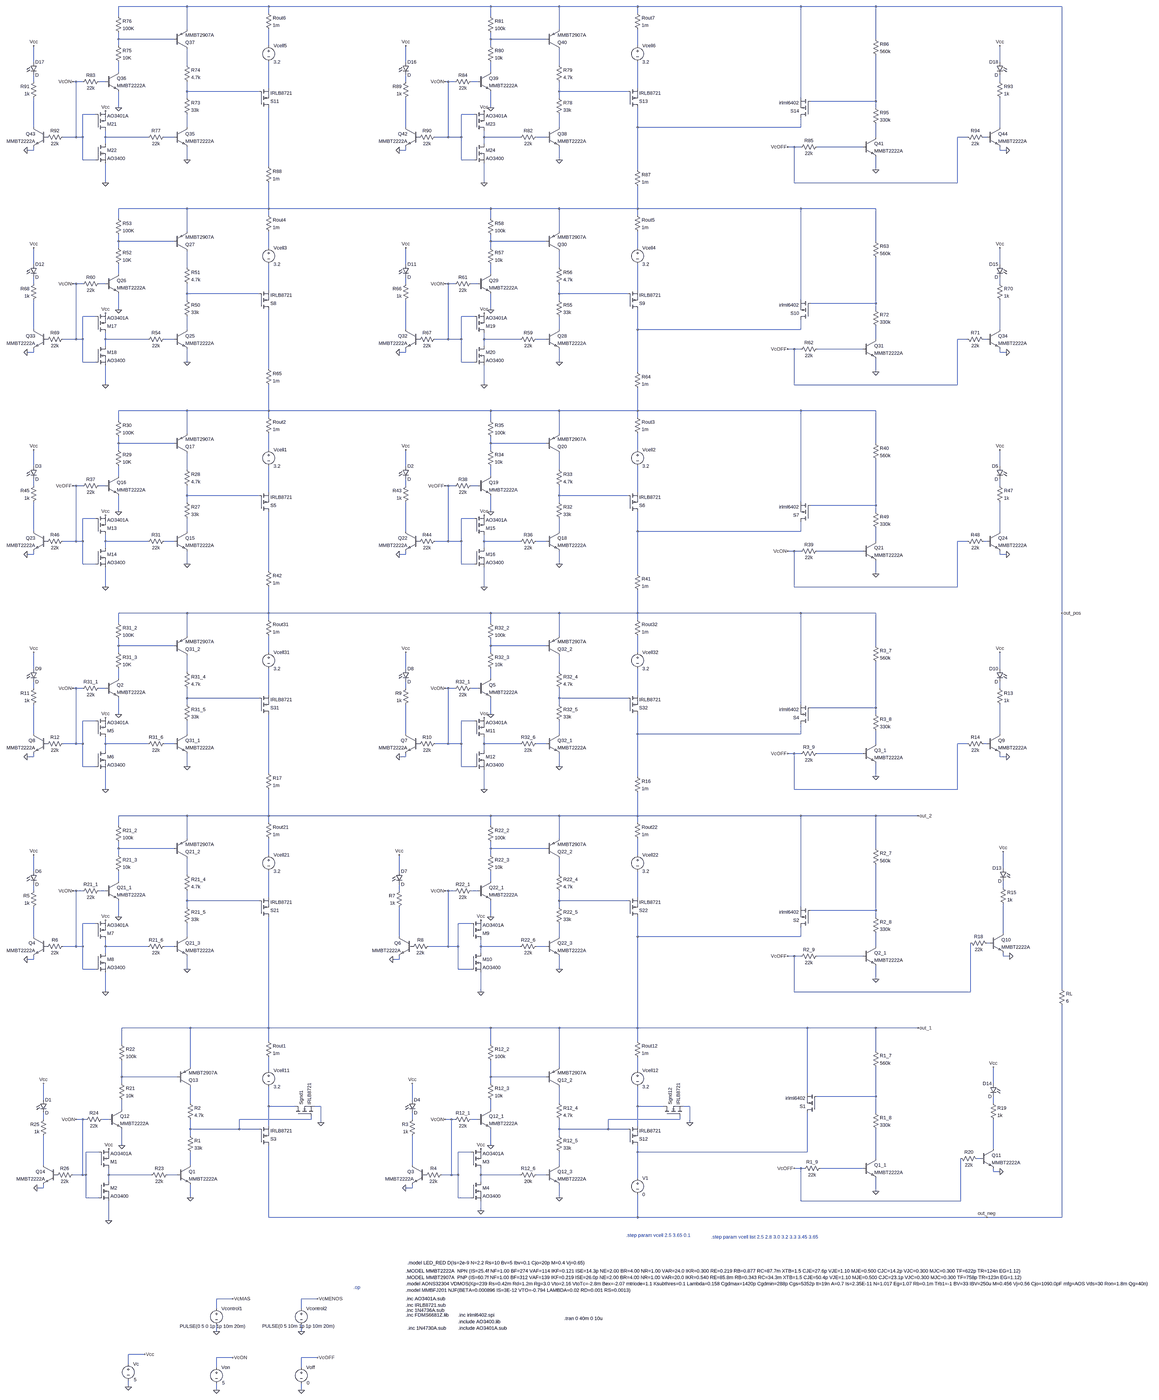
[diagram p0: schematic version_6x2.asc, whole sheet]
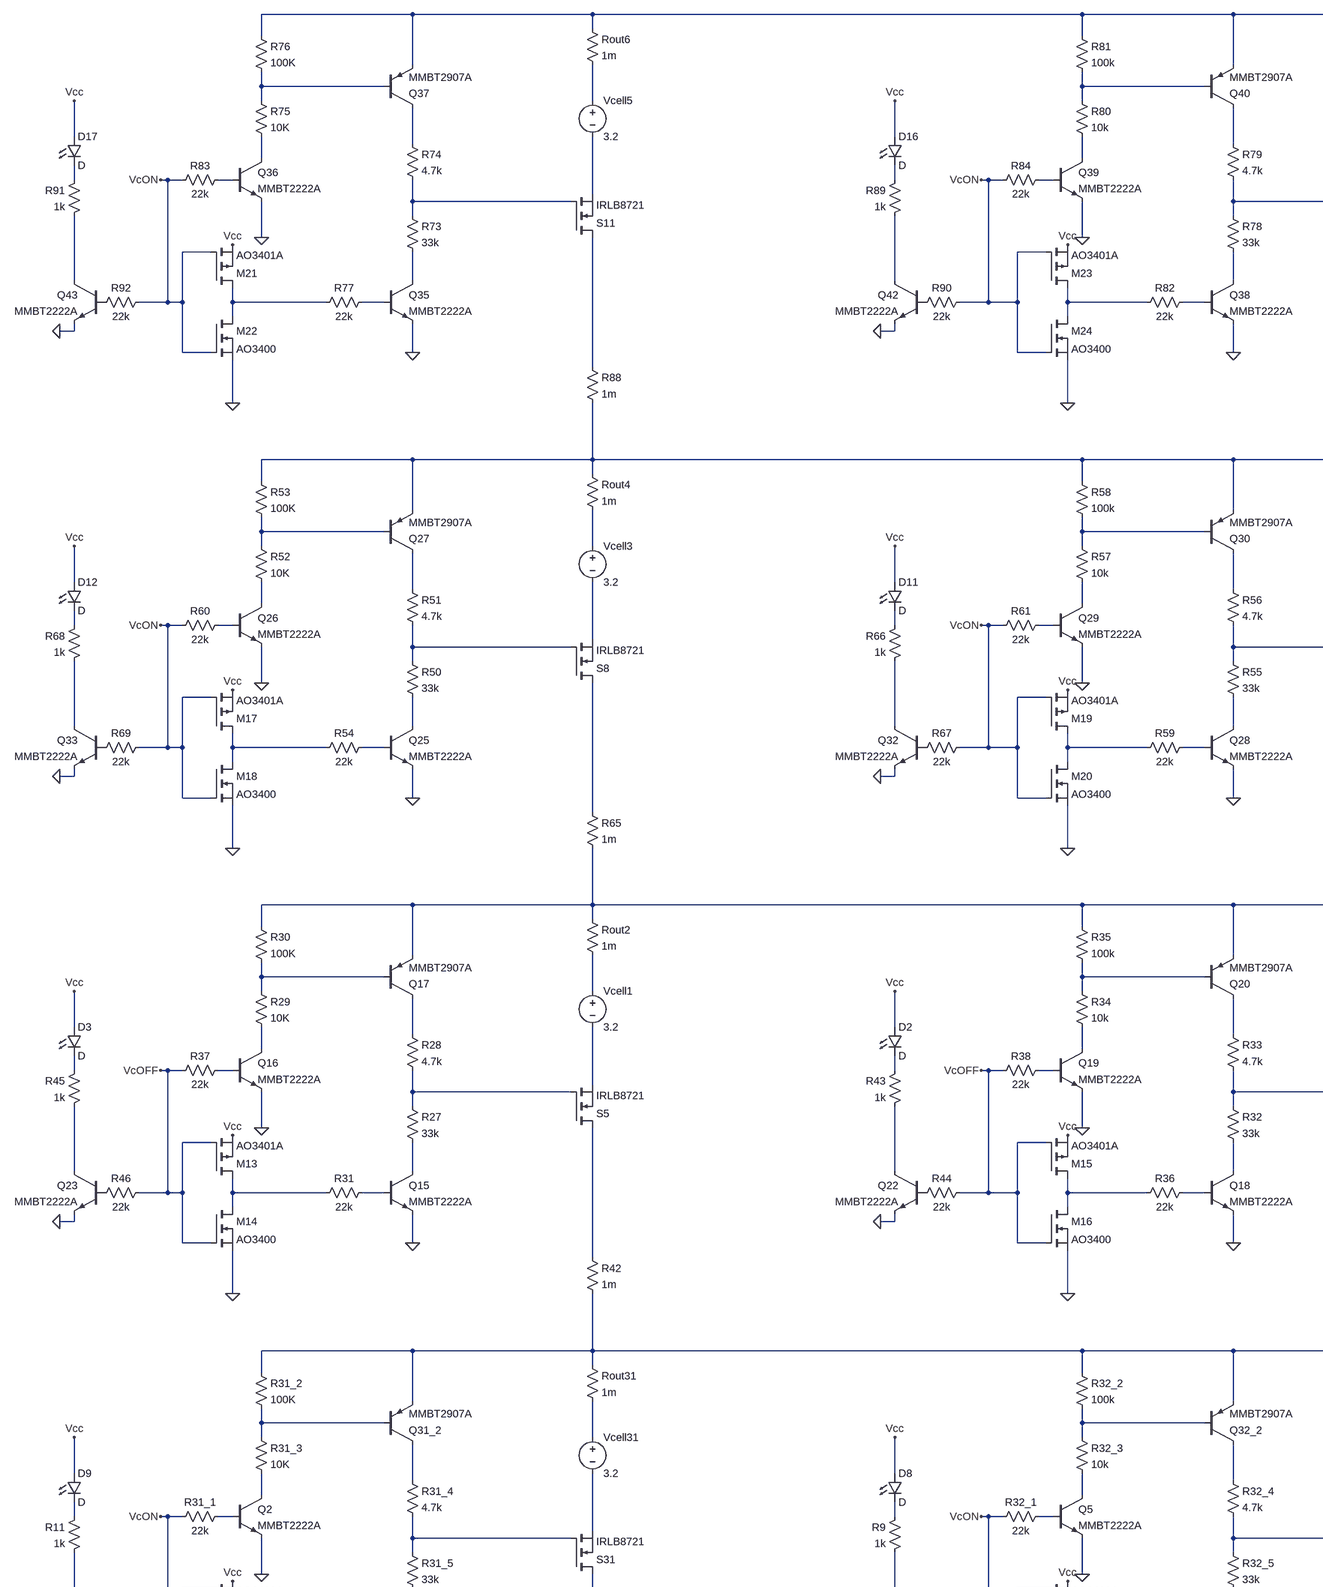
[diagram p1: schematic version_6x2.asc, part, row 1 of 2, column 1 of 2]
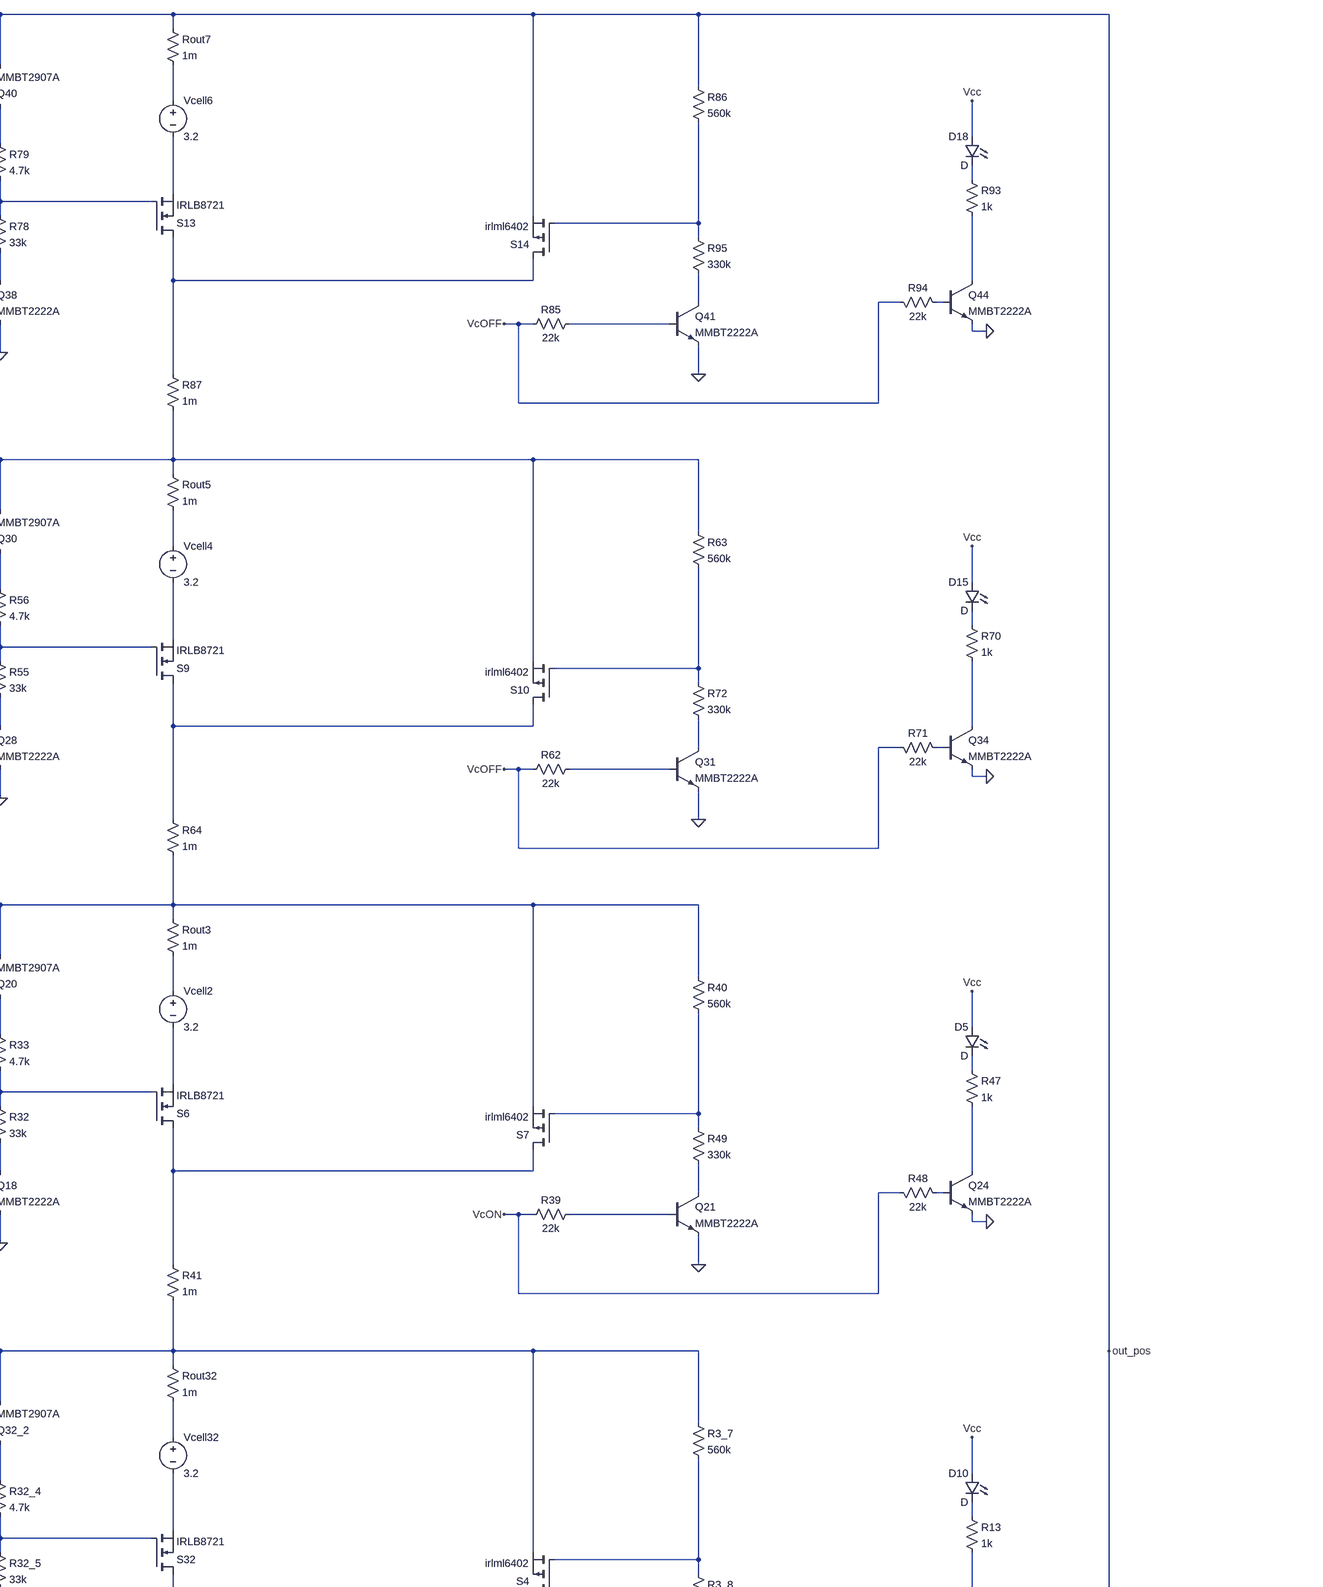
[diagram p2: schematic version_6x2.asc, part, row 1 of 2, column 2 of 2]
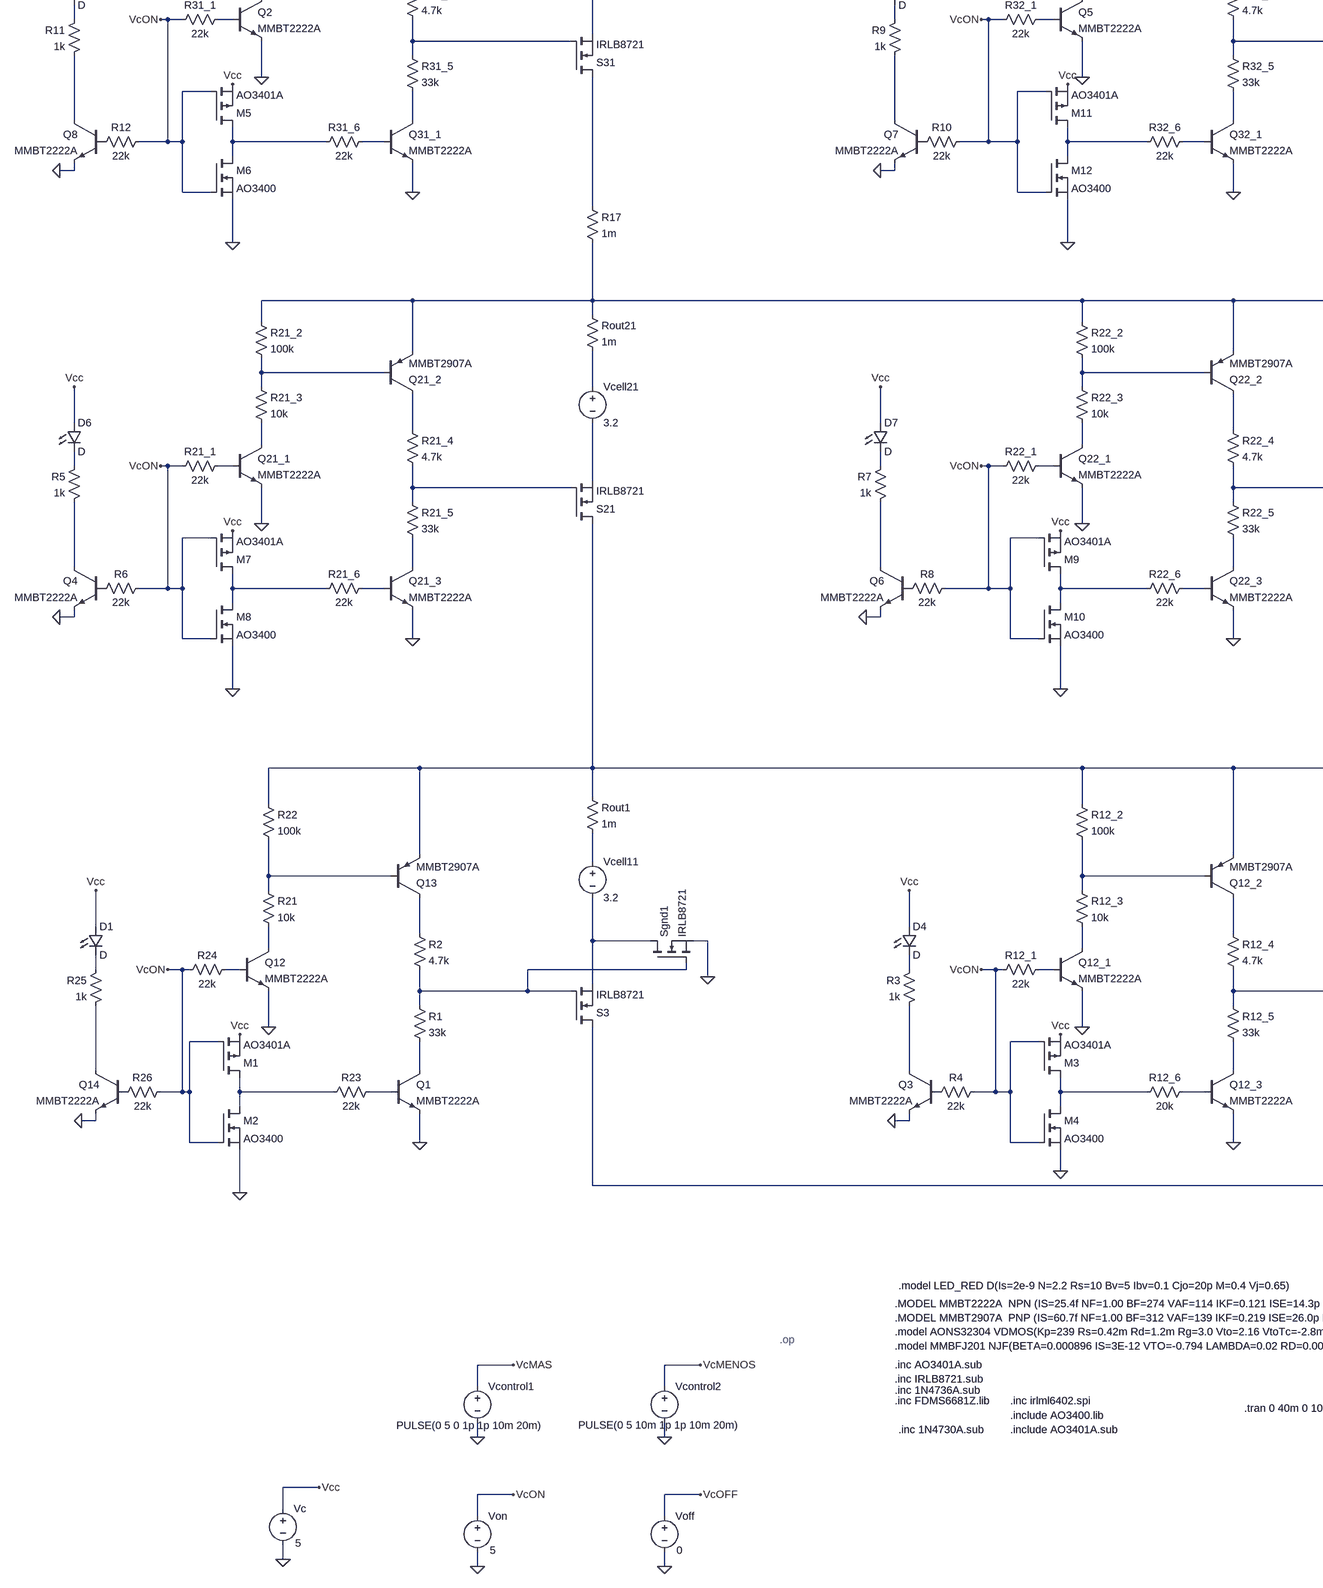
[diagram p3: schematic version_6x2.asc, part, row 2 of 2, column 1 of 2]
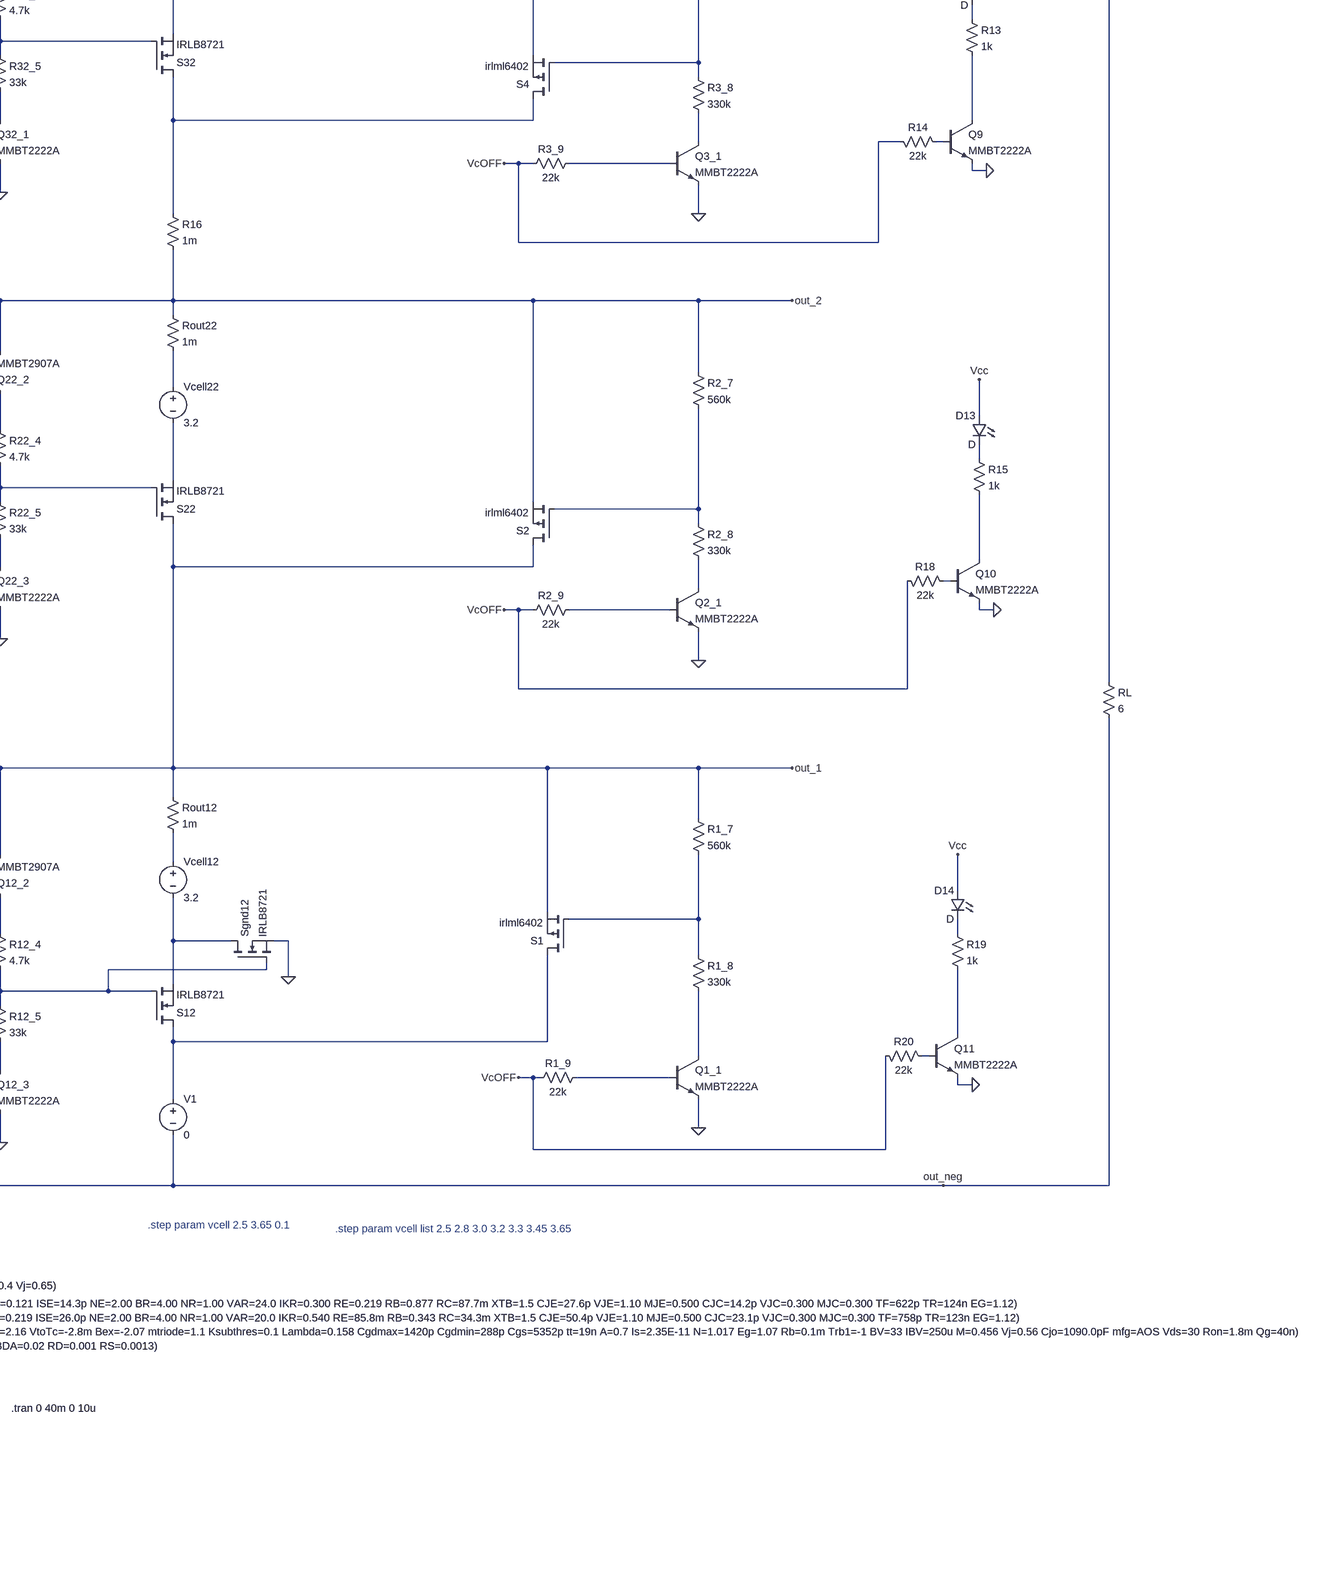
[diagram p4: schematic version_6x2.asc, part, row 2 of 2, column 2 of 2]
* version_6x2.asc
Q12_3 N187 N192 0 0 MMBT2222A
R12_5 N179 N187 33k
R12_4 N168 N179 4.7k
Q12_1 N173 N178 0 0 MMBT2222A
R12_3 N165 N173 10k
R12_2 out_1 N165 100k
R12_6 N192 N191 20k
Vcell12 N163 N171 3.2
Q12_2 N168 N165 out_1 0 MMBT2907A
X§S12 N181 N179 N171 IRLB8721  ; pins D G S
Q21_3 N152 N157 0 0 MMBT2222A
R21_5 N147 N152 33k
R21_4 N136 N147 4.7k
Q21_1 N138 N142 0 0 MMBT2222A
R21_3 N132 N138 10k
R21_2 out_2 N132 100k
R21_6 N157 N156 22k
Vcell21 N134 N145 3.2
Q21_2 N136 N132 out_2 0 MMBT2907A
X§S21 out_1 N147 N145 IRLB8721  ; pins D G S
Q22_3 N154 N159 0 0 MMBT2222A
R22_5 N148 N154 33k
R22_4 N137 N148 4.7k
Q22_1 N139 N144 0 0 MMBT2222A
R22_3 N133 N139 10k
R22_2 out_2 N133 100k
R22_6 N159 N158 22k
Vcell22 N135 N146 3.2
Q22_2 N137 N133 out_2 0 MMBT2907A
X§S22 out_1 N148 N146 IRLB8721  ; pins D G S
Vcontrol1 VcMAS 0 PULSE(0 5 0 1p 1p 10m 20m)
Vcontrol2 VcMENOS 0 PULSE(0 5 10m 1p 1p 10m 20m)
Voff VcOFF 0 0
Von VcON 0 5
R21_1 N142 VcON 22k
R22_1 N144 VcON 22k
R12_1 N178 VcON 22k
Rout12 out_1 N163 1m
Rout21 out_2 N134 1m
Rout22 out_2 N135 1m
Q1_1 N182 N188 0 0 MMBT2222A
R1_9 N188 VcOFF 22k
R1_7 out_1 N166 560k
Q2_1 N160 N161 0 0 MMBT2222A
R2_9 N161 VcOFF 22k
R2_7 out_2 N149 560k
X§Sgnd12 N171 N179 0 IRLB8721  ; pins D G S
Q31_1 N119 N125 0 0 MMBT2222A
R31_5 N115 N119 33k
R31_4 N104 N115 4.7k
Q2 N106 N109 0 0 MMBT2222A
R31_3 N100 N106 10K
R31_2 N099 N100 100K
R31_6 N125 N124 22k
Vcell31 N102 N113 3.2
Q31_2 N104 N100 N099 0 MMBT2907A
X§S31 N131 N115 N113 IRLB8721  ; pins D G S
Q32_1 N121 N127 0 0 MMBT2222A
R32_5 N116 N121 33k
R32_4 N105 N116 4.7k
Q5 N107 N111 0 0 MMBT2222A
R32_3 N101 N107 10k
R32_2 N099 N101 100k
R32_6 N127 N126 22k
Vcell32 N103 N114 3.2
Q32_2 N105 N101 N099 0 MMBT2907A
X§S32 N122 N116 N114 IRLB8721  ; pins D G S
R31_1 N109 VcON 22k
R32_1 N111 VcON 22k
Rout31 N099 N102 1m
Rout32 N099 N103 1m
Q3_1 N128 N130 0 0 MMBT2222A
R3_9 N130 VcOFF 22k
R3_7 N099 N117 560k
R16 N122 out_2 1m
R17 N131 out_2 1m
X§S4 N122 N117 N099 irlml6402  ; pins D G S
X§S2 out_1 N149 out_2 irlml6402  ; pins D G S
X§S1 N181 N166 out_1 irlml6402  ; pins D G S
V1 N181 out_neg 0
Q3 N186 P001 0 0 MMBT2222A
R3 N177 N186 1k
R4 VcON P001 22k
D4 Vcc N177 D
Q4 N151 P002 0 0 MMBT2222A
R5 N141 N151 1k
R6 VcON P002 22k
D6 Vcc N141 D
Q6 N153 P003 0 0 MMBT2222A
R7 N143 N153 1k
R8 VcON P003 22k
D7 Vcc N143 D
Q7 N120 P004 0 0 MMBT2222A
R9 N110 N120 1k
R10 VcON P004 22k
D8 Vcc N110 D
Q8 N118 P005 0 0 MMBT2222A
R11 N108 N118 1k
R12 VcON P005 22k
D9 Vcc N108 D
Q9 N123 N129 0 0 MMBT2222A
R13 N112 N123 1k
R14 VcOFF N129 22k
D10 Vcc N112 D
Q10 N150 N155 0 0 MMBT2222A
R15 N140 N150 1k
R18 VcOFF N155 22k
D13 Vcc N140 D
Q11 N180 N183 0 0 MMBT2222A
R19 N169 N180 1k
R20 VcOFF N183 22k
D14 Vcc N169 D
R1_8 N166 N182 330k
R2_8 N149 N160 330k
R3_8 N117 N128 330k
Q1 N185 N190 0 0 MMBT2222A
R1 N176 N185 33k
R2 N167 N176 4.7k
Q12 N172 N175 0 0 MMBT2222A
R21 N164 N172 10k
R22 out_1 N164 100k
R23 N190 N189 22k
Vcell11 N162 N170 3.2
Q13 N167 N164 out_1 0 MMBT2907A
X§S3 out_neg N176 N170 IRLB8721  ; pins D G S
R24 N175 VcON 22k
Rout1 out_1 N162 1m
X§Sgnd1 N170 N176 0 IRLB8721  ; pins D G S
Q14 N184 P006 0 0 MMBT2222A
R25 N174 N184 1k
R26 VcON P006 22k
D1 Vcc N174 D
RL out_pos out_neg 6
X§M1 N189 VcON Vcc AO3401A  ; pins D G S
X§M2 N189 VcON 0 AO3400  ; pins D G S
Vc Vcc 0 5
X§M3 N191 VcON Vcc AO3401A  ; pins D G S
X§M4 N191 VcON 0 AO3400  ; pins D G S
X§M5 N124 VcON Vcc AO3401A  ; pins D G S
X§M6 N124 VcON 0 AO3400  ; pins D G S
X§M7 N156 VcON Vcc AO3401A  ; pins D G S
X§M8 N156 VcON 0 AO3400  ; pins D G S
X§M9 N158 VcON Vcc AO3401A  ; pins D G S
X§M10 N158 VcON 0 AO3400  ; pins D G S
X§M11 N126 VcON Vcc AO3401A  ; pins D G S
X§M12 N126 VcON 0 AO3400  ; pins D G S
Q15 N086 N092 0 0 MMBT2222A
R27 N082 N086 33k
R28 N071 N082 4.7k
Q16 N073 N076 0 0 MMBT2222A
R29 N067 N073 10K
R30 N066 N067 100K
R31 N092 N091 22k
Vcell1 N069 N080 3.2
Q17 N071 N067 N066 0 MMBT2907A
X§S5 N098 N082 N080 IRLB8721  ; pins D G S
Q18 N088 N094 0 0 MMBT2222A
R32 N083 N088 33k
R33 N072 N083 4.7k
Q19 N074 N078 0 0 MMBT2222A
R34 N068 N074 10k
R35 N066 N068 100k
R36 N094 N093 22k
Vcell2 N070 N081 3.2
Q20 N072 N068 N066 0 MMBT2907A
X§S6 N089 N083 N081 IRLB8721  ; pins D G S
R37 N076 VcOFF 22k
R38 N078 VcOFF 22k
Rout2 N066 N069 1m
Rout3 N066 N070 1m
Q21 N095 N097 0 0 MMBT2222A
R39 N097 VcON 22k
R40 N066 N084 560k
R41 N089 N099 1m
R42 N098 N099 1m
X§S7 N089 N084 N066 irlml6402  ; pins D G S
Q22 N087 P007 0 0 MMBT2222A
R43 N077 N087 1k
R44 VcOFF P007 22k
D2 Vcc N077 D
Q23 N085 P008 0 0 MMBT2222A
R45 N075 N085 1k
R46 VcOFF P008 22k
D3 Vcc N075 D
Q24 N090 N096 0 0 MMBT2222A
R47 N079 N090 1k
R48 VcON N096 22k
D5 Vcc N079 D
R49 N084 N095 330k
X§M13 N091 VcOFF Vcc AO3401A  ; pins D G S
X§M14 N091 VcOFF 0 AO3400  ; pins D G S
X§M15 N093 VcOFF Vcc AO3401A  ; pins D G S
X§M16 N093 VcOFF 0 AO3400  ; pins D G S
Q25 N053 N059 0 0 MMBT2222A
R50 N049 N053 33k
R51 N038 N049 4.7k
Q26 N040 N043 0 0 MMBT2222A
R52 N034 N040 10K
R53 N033 N034 100K
R54 N059 N058 22k
Vcell3 N036 N047 3.2
Q27 N038 N034 N033 0 MMBT2907A
X§S8 N065 N049 N047 IRLB8721  ; pins D G S
Q28 N055 N061 0 0 MMBT2222A
R55 N050 N055 33k
R56 N039 N050 4.7k
Q29 N041 N045 0 0 MMBT2222A
R57 N035 N041 10k
R58 N033 N035 100k
R59 N061 N060 22k
Vcell4 N037 N048 3.2
Q30 N039 N035 N033 0 MMBT2907A
X§S9 N056 N050 N048 IRLB8721  ; pins D G S
R60 N043 VcON 22k
R61 N045 VcON 22k
Rout4 N033 N036 1m
Rout5 N033 N037 1m
Q31 N062 N064 0 0 MMBT2222A
R62 N064 VcOFF 22k
R63 N033 N051 560k
R64 N056 N066 1m
R65 N065 N066 1m
X§S10 N056 N051 N033 irlml6402  ; pins D G S
Q32 N054 P009 0 0 MMBT2222A
R66 N044 N054 1k
R67 VcON P009 22k
D11 Vcc N044 D
Q33 N052 P010 0 0 MMBT2222A
R68 N042 N052 1k
R69 VcON P010 22k
D12 Vcc N042 D
Q34 N057 N063 0 0 MMBT2222A
R70 N046 N057 1k
R71 VcOFF N063 22k
D15 Vcc N046 D
R72 N051 N062 330k
X§M17 N058 VcON Vcc AO3401A  ; pins D G S
X§M18 N058 VcON 0 AO3400  ; pins D G S
X§M19 N060 VcON Vcc AO3401A  ; pins D G S
X§M20 N060 VcON 0 AO3400  ; pins D G S
Q35 N020 N026 0 0 MMBT2222A
R73 N016 N020 33k
R74 N005 N016 4.7k
Q36 N007 N010 0 0 MMBT2222A
R75 N001 N007 10K
R76 out_pos N001 100K
R77 N026 N025 22k
Vcell5 N003 N014 3.2
Q37 N005 N001 out_pos 0 MMBT2907A
X§S11 N032 N016 N014 IRLB8721  ; pins D G S
Q38 N022 N028 0 0 MMBT2222A
R78 N017 N022 33k
R79 N006 N017 4.7k
Q39 N008 N012 0 0 MMBT2222A
R80 N002 N008 10k
R81 out_pos N002 100k
R82 N028 N027 22k
Vcell6 N004 N015 3.2
Q40 N006 N002 out_pos 0 MMBT2907A
X§S13 N023 N017 N015 IRLB8721  ; pins D G S
R83 N010 VcON 22k
R84 N012 VcON 22k
Rout6 out_pos N003 1m
Rout7 out_pos N004 1m
Q41 N029 N031 0 0 MMBT2222A
R85 N031 VcOFF 22k
R86 out_pos N018 560k
R87 N023 N033 1m
R88 N032 N033 1m
X§S14 N023 N018 out_pos irlml6402  ; pins D G S
Q42 N021 P011 0 0 MMBT2222A
R89 N011 N021 1k
R90 VcON P011 22k
D16 Vcc N011 D
Q43 N019 P012 0 0 MMBT2222A
R91 N009 N019 1k
R92 VcON P012 22k
D17 Vcc N009 D
Q44 N024 N030 0 0 MMBT2222A
R93 N013 N024 1k
R94 VcOFF N030 22k
D18 Vcc N013 D
R95 N018 N029 330k
X§M21 N025 VcON Vcc AO3401A  ; pins D G S
X§M22 N025 VcON 0 AO3400  ; pins D G S
X§M23 N027 VcON Vcc AO3401A  ; pins D G S
X§M24 N027 VcON 0 AO3400  ; pins D G S
.model D D
.lib standard.dio
.model NPN NPN
.model PNP PNP
.lib standard.bjt
.tran 0 40m 0 10u
.MODEL MMBT2222A  NPN (IS=25.4f NF=1.00 BF=274 VAF=114 IKF=0.121 ISE=14.3p NE=2.00 BR=4.00 NR=1.00 VAR=24.0 IKR=0.300 RE=0.219 RB=0.877 RC=87.7m XTB=1.5 CJE=27.6p VJE=1.10 MJE=0.500 CJC=14.2p VJC=0.300 MJC=0.300 TF=622p TR=124n EG=1.12)
.MODEL MMBT2907A  PNP (IS=60.7f NF=1.00 BF=312 VAF=139 IKF=0.219 ISE=26.0p NE=2.00 BR=4.00 NR=1.00 VAR=20.0 IKR=0.540 RE=85.8m RB=0.343 RC=34.3m XTB=1.5 CJE=50.4p VJE=1.10 MJE=0.500 CJC=23.1p VJC=0.300 MJC=0.300 TF=758p TR=123n EG=1.12)
.model AONS32304 VDMOS(Kp=239 Rs=0.42m Rd=1.2m Rg=3.0 Vto=2.16 VtoTc=-2.8m Bex=-2.07 mtriode=1.1 Ksubthres=0.1 Lambda=0.158 Cgdmax=1420p Cgdmin=288p Cgs=5352p tt=19n A=0.7 Is=2.35E-11 N=1.017 Eg=1.07 Rb=0.1m Trb1=-1 BV=33 IBV=250u M=0.456 Vj=0.56 Cjo=1090.0pF mfg=AOS Vds=30 Ron=1.8m Qg=40n)
.model MMBFJ201 NJF(BETA=0.000896 IS=3E-12 VTO=-0.794 LAMBDA=0.02 RD=0.001 RS=0.0013)
.inc AO3401A.sub
.inc IRLB8721.sub
.inc 1N4736A.sub
.inc FDMS6681Z.lib
.inc 1N4730A.sub
.model LED_RED D(Is=2e-9 N=2.2 Rs=10 Bv=5 Ibv=0.1 Cjo=20p M=0.4 Vj=0.65)
.inc irlml6402.spi
.include AO3400.lib
.include AO3401A.sub
* .op
* .step param vcell 2.5 3.65 0.1
* .step param vcell list 2.5 2.8 3.0 3.2 3.3 3.45 3.65
.backanno
.end